# EAGLE design CleverBoard_V1 (EAGLE 9.6.2)

## Sheet 1 of 2
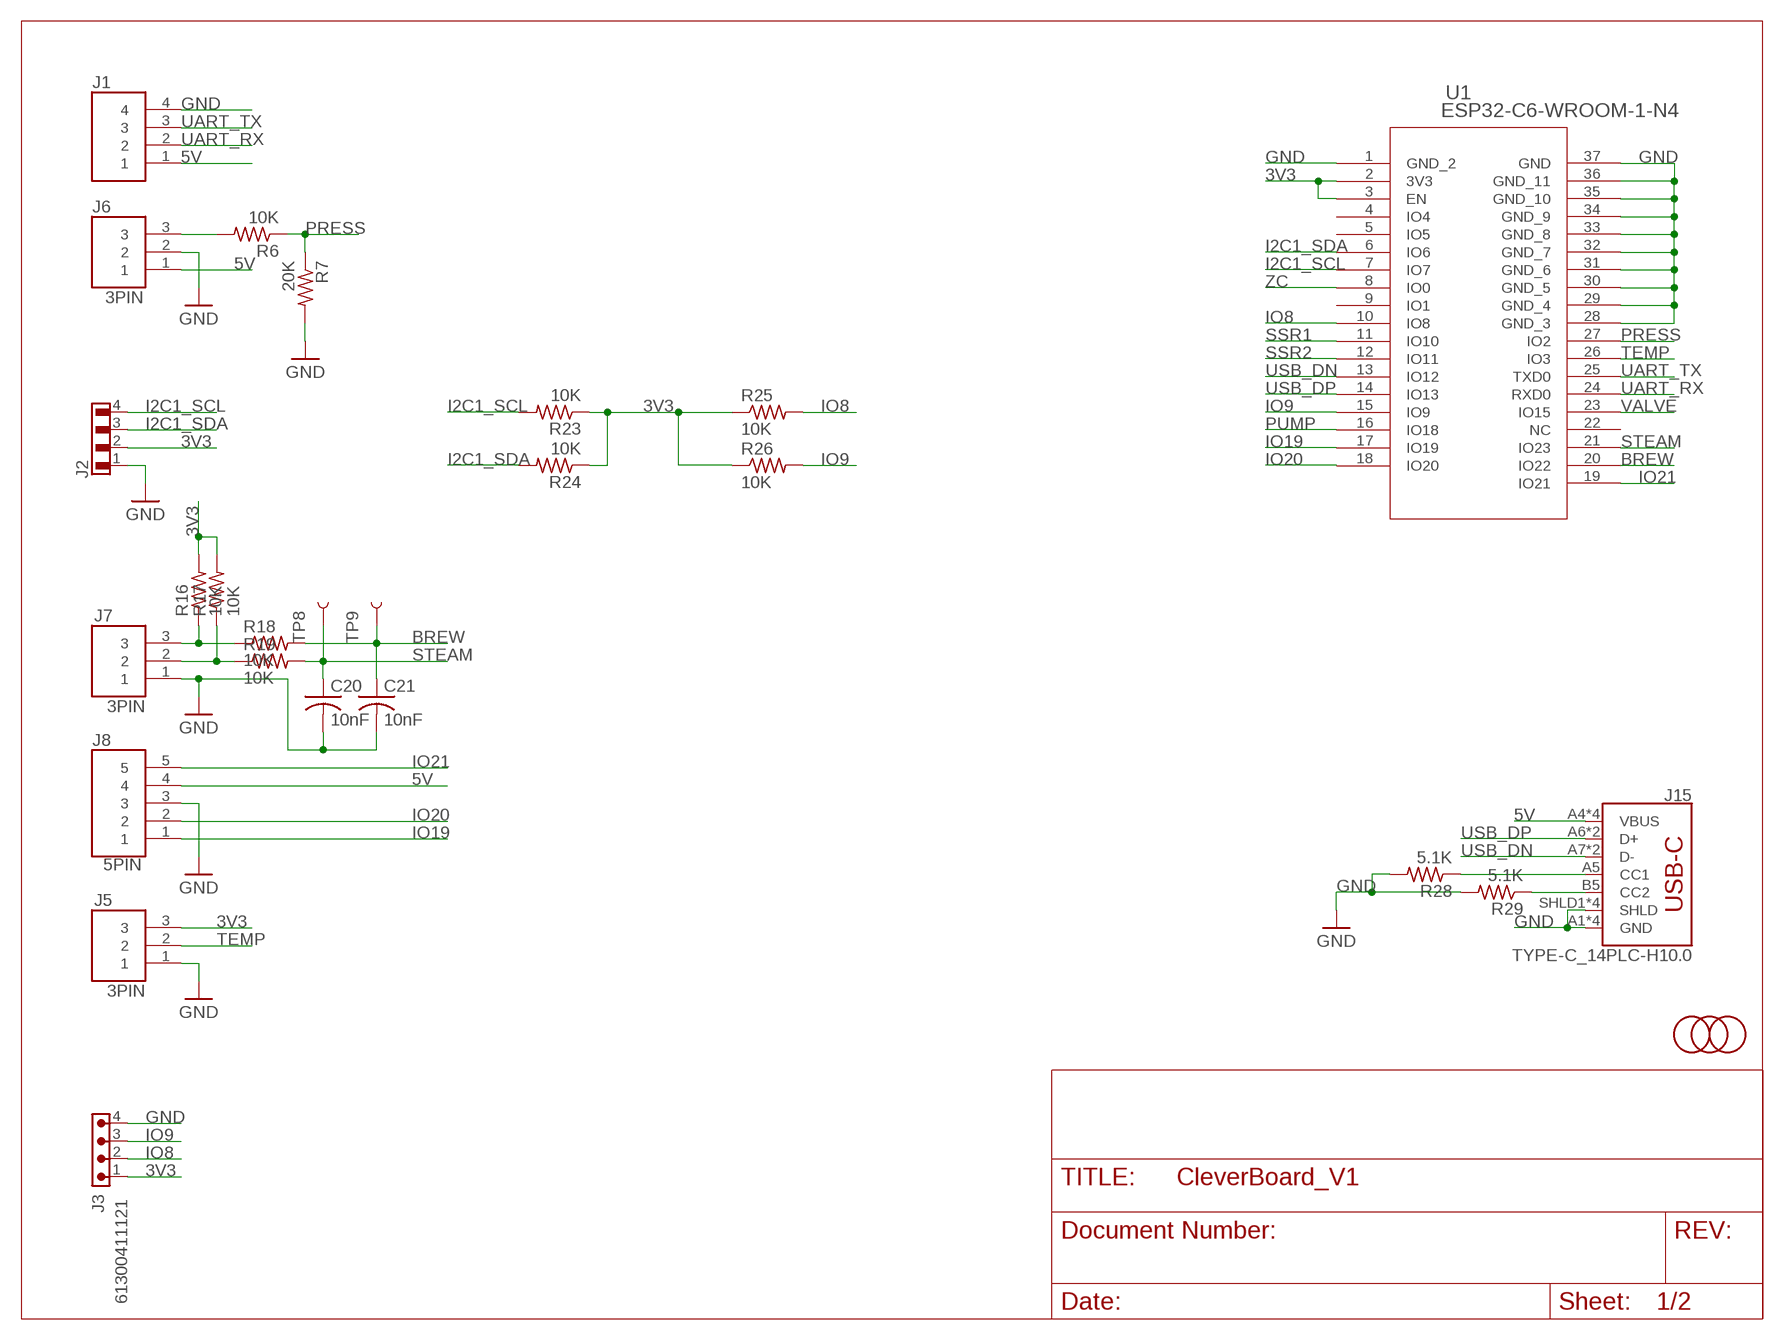
[diagram p0: schematic, sheet 1]

### Parts
C20  10nF  C-USC0603  [C0603]
C21  10nF  C-USC0603  [C0603]
J1  4PIN  [B4B-PH-K-S]
J2  665104131822  [665104131822]
J3  61300411121  6130XX11121_61300411121  [61300411121]
J5  3PIN  [B3B-PH-K-S]
J6  3PIN  [B3B-PH-K-S]
J7  3PIN  [B3B-PH-K-S]
J8  5PIN  [B5B-PH-K-S]
J15  TYPE-C_14PLC-H10.0  [TYPE-C_14PLC-H10.0]
MARK1  FIDUCIAL  [FIDUCIAL_1MM]
MARK2  FIDUCIAL  [FIDUCIAL_1MM]
MARK5  FIDUCIAL  [FIDUCIAL_1MM]
R6  10K  R-US_R0603  [R0603]
R7  20K  R-US_R0603  [R0603]
R16  10K  R-US_R0603  [R0603]
R17  10K  R-US_R0603  [R0603]
R18  10K  R-US_R0603  [R0603]
R19  10K  R-US_R0603  [R0603]
R23  10K  R-US_R0603  [R0603]
R24  10K  R-US_R0603  [R0603]
R25  10K  R-US_R0603  [R0603]
R26  10K  R-US_R0603  [R0603]
R28  5.1K  R-US_R0603  [R0603]
R29  5.1K  R-US_R0603  [R0603]
TP8  TEST-POINT3  [PAD.03X.03]
TP9  TEST-POINT3  [PAD.03X.03]
U1  ESP32-C6-WROOM-1-N4  [MOD28_ESP32-C6-WROOM-1_EXP]

### Nets
3V3: J2.2 J3.1 J5.3 R16.2 R17.2 R23.1 R24.1 R25.1 R26.1 U1.2(3V3) U1.3(EN) ; also sheet 2
5V: J1.1 J6.1 J8.4 J15.A4(VBUS) J15.A9(VBUS) J15.B4(VBUS) J15.B9(VBUS) ; also sheet 2
BREW: C21.1 R18.2 TP9.1 U1.20(IO22)
CC1: J15.A5(CC1) R28.1
CC2: J15.B5(CC2) R29.1
GND: C20.2 C21.2 J1.4 J2.1 J3.4 J5.1 J6.2 J7.1 J8.3 J15.A1(GND) J15.A12(GND) J15.B1(GND) J15.B12(GND) J15.SHLD1(SHLD) J15.SHLD2(SHLD) J15.SHLD3(SHLD) J15.SHLD4(SHLD) R7.2 R28.2 R29.2 U1.1(GND_2) U1.28(GND_3) U1.29(GND_4) U1.30(GND_5) U1.31(GND_6) U1.32(GND_7) U1.33(GND_8) U1.34(GND_9) U1.35(GND_10) U1.36(GND_11) U1.37(GND) ; also sheet 2
I2C1_SCL: J2.4 R23.2 U1.7(IO7)
I2C1_SDA: J2.3 R24.2 U1.6(IO6)
IO8: J3.2 R25.2 U1.10(IO8)
IO9: J3.3 R26.2 U1.15(IO9)
IO19: J8.1 U1.17(IO19)
IO20: J8.2 U1.18(IO20)
IO21: J8.5 U1.19(IO21)
N$5: J7.3 R16.1 R18.1
N$6: J7.2 R17.1 R19.1
N$25: J6.3 R6.2
PRESS: R6.1 R7.1 U1.27(IO2)
PUMP: U1.16(IO18) ; also sheet 2
SSR1: U1.11(IO10) ; also sheet 2
SSR2: U1.12(IO11) ; also sheet 2
STEAM: C20.1 R19.2 TP8.1 U1.21(IO23)
TEMP: J5.2 U1.26(IO3)
UART_RX: J1.2 U1.24(RXD0)
UART_TX: J1.3 U1.25(TXD0)
USB_DN: J15.A7(D-) J15.B7(D-) U1.13(IO12)
USB_DP: J15.A6(D+) J15.B6(D+) U1.14(IO13)
VALVE: U1.23(IO15) ; also sheet 2
ZC: U1.8(IO0) ; also sheet 2
Unconnected: U1.4(IO4) U1.5(IO5) U1.9(IO1) U1.22(NC)

## Sheet 2 of 2
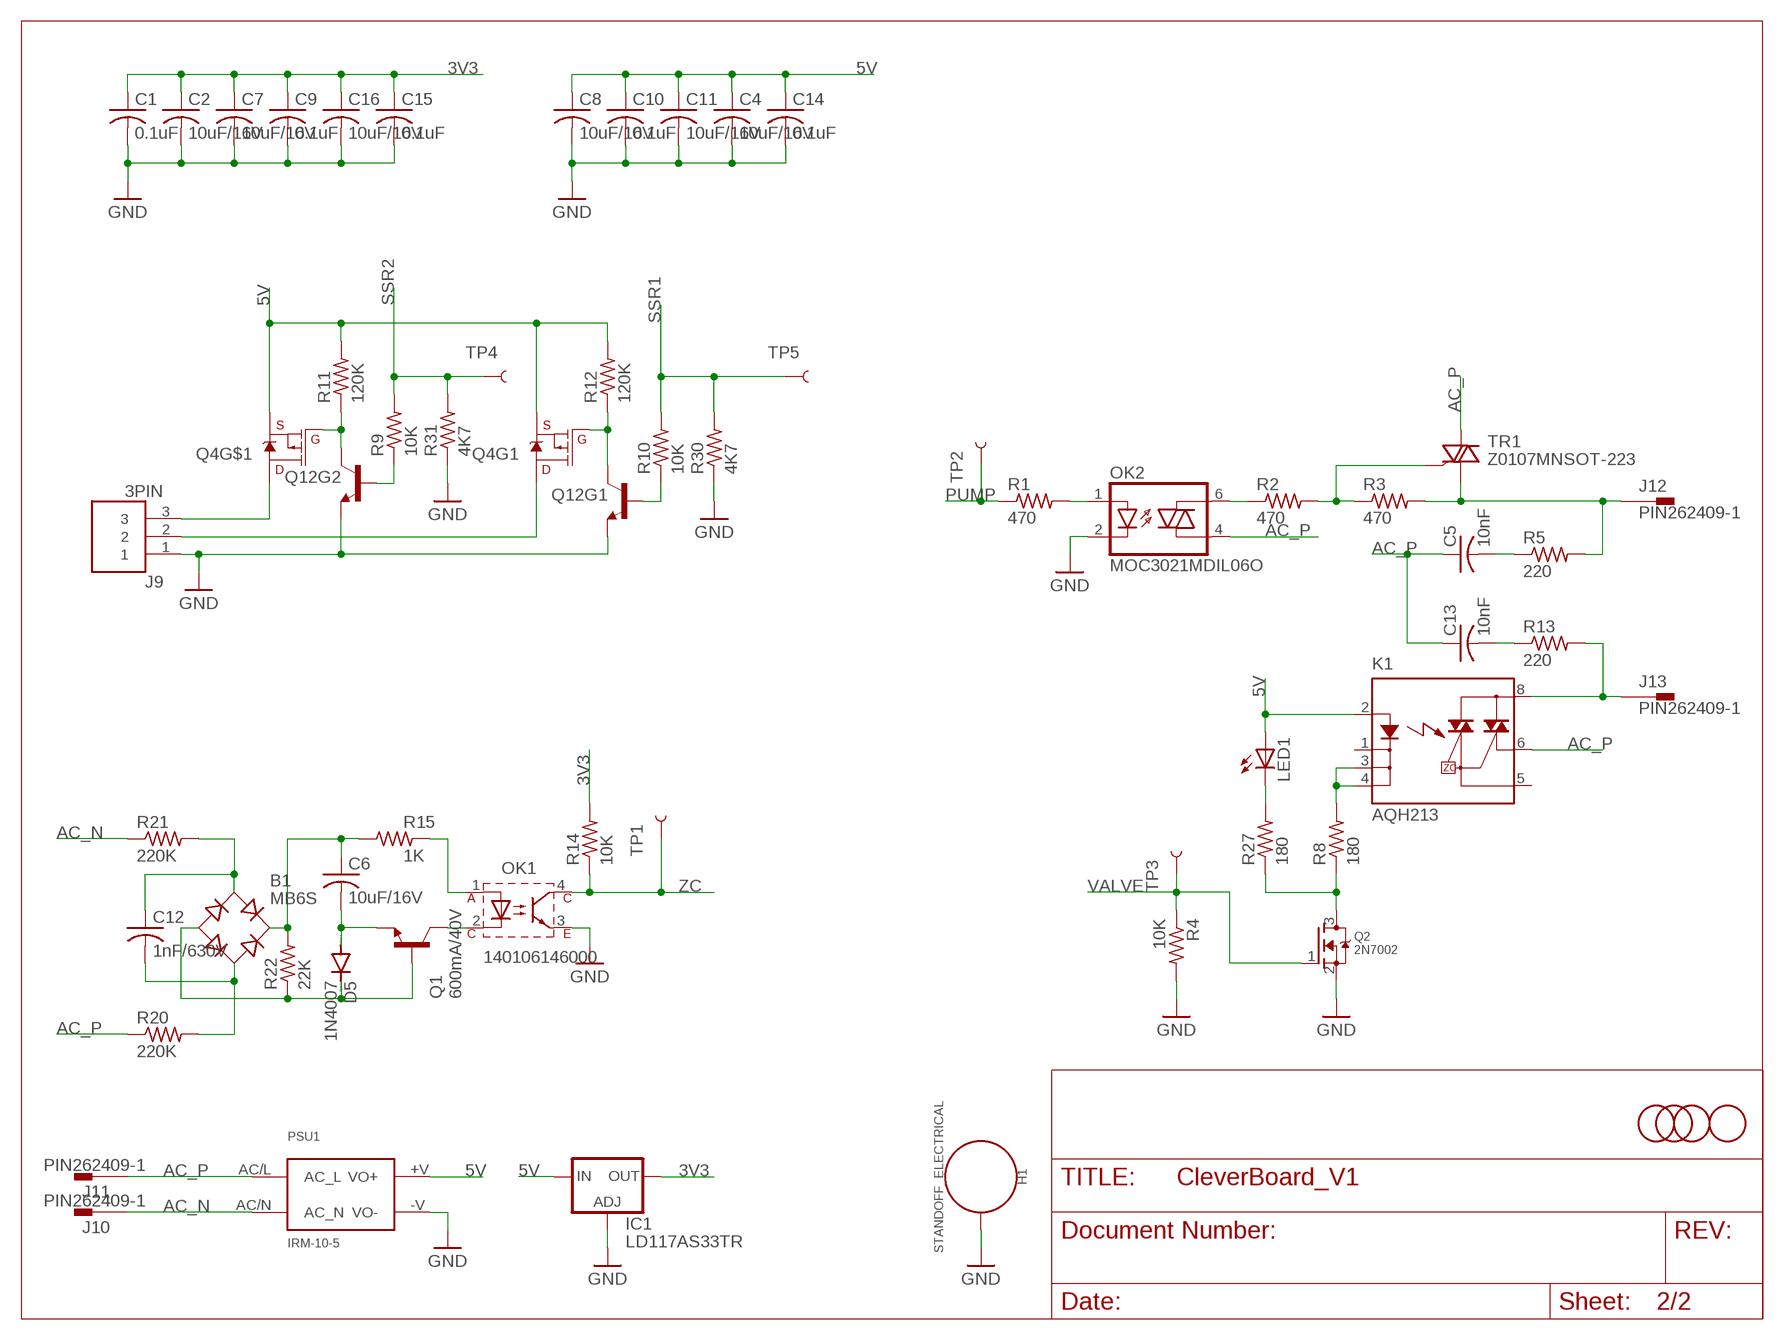
[diagram p1: schematic, sheet 2]

### Parts
B1  MB6S  [SOIC-4]
C1  0.1uF  C-USC0603  [C0603]
C2  10uF/16V  C-USC0603  [C0603]
C4  10uF/16V  C-USC0603  [C0603]
C5  10nF  C-USC1206  [C1206]
C6  10uF/16V  C-USC0603  [C0603]
C7  10uF/16V  C-USC0603  [C0603]
C8  10uF/16V  C-USC0603  [C0603]
C9  0.1uF  C-USC0603  [C0603]
C10  0.1uF  C-USC0603  [C0603]
C11  10uF/16V  C-USC0603  [C0603]
C12  1nF/630V  C-USC0805  [C0805]
C13  10nF  C-USC1206  [C1206]
C14  0.1uF  C-USC0603  [C0603]
C15  0.1uF  C-USC0603  [C0603]
C16  10uF/16V  C-USC0603  [C0603]
D5  1N4007  DIODE-DO214AC  [DO214AC]
H1  STANDOFF_ELECTRICAL  [STANDOFF-ELECTRICAL]
IC1  LD117AS33TR  [SOT223]
J9  3PIN  [B3B-PH-K-S]
J10  PIN262409-1  [62409-1]
J11  PIN262409-1  [62409-1]
J12  PIN262409-1  [62409-1]
J13  PIN262409-1  [62409-1]
K1  AQH213  [DIL07]
LED1  LEDCHIP-LED0603  [CHIP-LED0603]
MARK4  FIDUCIAL  [FIDUCIAL_1MM]
MARK6  FIDUCIAL  [FIDUCIAL_1MM]
MARK7  FIDUCIAL  [FIDUCIAL_1MM]
MARK8  FIDUCIAL  [FIDUCIAL_1MM]
OK1  140106146000  WL-OCPT_SERIES_101X_140106146000  [WL-OCPT_LSOP4]
OK2  MOC3021MDIL06O  [DIL06O]
PSU1  IRM-10-5  [IRM-10]
Q1  600mA/40V  TRANS_NPN-MMBT2222AL  [SOT23-3]
Q2  2N7002  MOSFET-NREFLOW  [SOT23-R]
Q4  MOSFET_PCH_DUAL-DMP2240UDM  [SOT26]
Q12  TRANS_NPN_DUAL-MBT3904DW1T1  [SC70-6]
R1  470  R-US_R0603  [R0603]
R2  470  R-US_R0603  [R0603]
R3  470  R-US_R0603  [R0603]
R4  10K  R-US_R0603  [R0603]
R5  220  R-US_R2512  [R2512]
R8  180  R-US_R0603  [R0603]
R9  10K  R-US_R0603  [R0603]
R10  10K  R-US_R0603  [R0603]
R11  120K  R-US_R0603  [R0603]
R12  120K  R-US_R0603  [R0603]
R13  220  R-US_R2512  [R2512]
R14  10K  R-US_R0603  [R0603]
R15  1K  R-US_R0603  [R0603]
R20  220K  R-US_R1206  [R1206]
R21  220K  R-US_R1206  [R1206]
R22  22K  R-US_R0603  [R0603]
R27  180  R-US_R0603  [R0603]
R30  4K7  R-US_R0603  [R0603]
R31  4K7  R-US_R0603  [R0603]
TP1  TEST-POINT3  [PAD.03X.03]
TP2  TEST-POINT3  [PAD.03X.03]
TP3  TEST-POINT3  [PAD.03X.03]
TP4  TEST-POINT3  [PAD.03X.03]
TP5  TEST-POINT3  [PAD.03X.03]
TR1  Z0107MNSOT-223  [SOT223]

### Nets
3V3: C1.1 C2.1 C7.1 C9.1 C15.1 C16.1 IC1.4(OUT) R14.2 ; also sheet 1
3WAY: J13.A1 J13.A2 K1.8(DS1) R13.2
5V: C4.1 C8.1 C10.1 C11.1 C14.1 IC1.3(IN) K1.2(A) LED1.A PSU1.+V(VO+) Q4.S1(S) Q4.S2(S) R11.2 R12.2 ; also sheet 1
AC_N: J10.A1 J10.A2 PSU1.AC/N(AC_N) R21.1
AC_P: C5.1 C13.1 J11.A1 J11.A2 K1.6(DS3) OK2.4(A1) PSU1.AC/L(AC_L) R20.1 TR1.2(A2) TR1.4(A2)
GND: C1.2 C2.2 C4.2 C7.2 C8.2 C9.2 C10.2 C11.2 C14.2 C15.2 C16.2 H1.P1 IC1.1(ADJ) J9.1 OK1.3 OK2.2(C) PSU1.-V(VO-) Q2.2(S) Q12.1(E) Q12.4(E) R4.2 R30.1 R31.1 ; also sheet 1
N$2: B1.- D5.C Q1.1(B) R22.1
N$3: LED1.C R27.2
N$4: OK2.6(A2) R2.1
N$7: OK1.2 Q1.3(C)
N$8: R2.2 R3.1 TR1.3(G)
N$11: Q2.3(D) R8.1 R27.1
N$13: K1.3(K1) K1.4(K2) R8.2
N$15: C13.2 R13.1
N$16: C5.2 R5.1
N$36: B1.~1(AC1) C12.2 R20.2
N$37: B1.~2(AC2) C12.1 R21.2
N$39: OK2.1(A) R1.2
N$43: C6.2 D5.A Q1.2(E)
N$44: OK1.1 R15.2
N$45: B1.+ C6.1 R15.1 R22.2
N$46: Q12.2(B) R9.1
N$47: Q4.G1(G) Q12.3(C) R12.1
N$48: Q4.G2(G) Q12.6(C) R11.1
N$49: Q12.5(B) R10.1
PUMP: R1.1 TP2.1 ; also sheet 1
PUMP_P: J12.A1 J12.A2 R3.2 R5.2 TR1.1(A1)
R1: J9.2 Q4.D1(D)
R2: J9.3 Q4.D2(D)
SSR1: R10.2 R30.2 TP5.1 ; also sheet 1
SSR2: R9.2 R31.2 TP4.1 ; also sheet 1
VALVE: Q2.1(G) R4.1 TP3.1 ; also sheet 1
ZC: OK1.4 R14.1 TP1.1 ; also sheet 1
Unconnected: K1.1(K) K1.5(DS2)

## Library data of the parts
B1 = rectifier:MB*S: Bridge Rectifier Source: http://www.fairchildsemi.com/ds/MB/MB6S.pdf; LCSC: C2487
C1 C9 C10 C14 C15 = rcl:C-US: CAPACITOR, American symbol; LCSC: C1591; SPICEPREFIX: C
C2 C4 C6-C8 C11 C16 = rcl:C-US: CAPACITOR, American symbol; LCSC: C86275; SPICEPREFIX: C
C5 C13 = rcl:C-US: CAPACITOR, American symbol; LCSC: C107192; SPICEPREFIX: C
C12 = rcl:C-US: CAPACITOR, American symbol; LCSC: C501242; SPICEPREFIX: C
C20 C21 = rcl:C-US: CAPACITOR, American symbol; LCSC: C100042; SPICEPREFIX: C
D5 = diode:DIODE-: DIODE; LCSC: C727081
H1 = SparkFun-Hardware:STANDOFF_ELECTRICAL: Stand Off Drill holes with an electrical connection. For example, use these to ground your board to a chassis. Example SparkFun Products Screw - Phillips Head (1/4", 4-40, 10 pack) <https://www.sparkfun.com/products/10453> (PRT-10453) Screw - Phillips Head (1/2", 4-40, 10 pack) <https://www.sparkfun.com/products/10452> (PRT-10452) Screw - Phillips Head (3/4", 4-40, 10 pack) <https://www.sparkfun.com/products/10451> (PRT-10451) Screw - Phillips Head (1", 4-40, 10 pack) <https://www.sparkfun.com/products/10450> (PRT-10450)
IC1 = v-reg:LD117A?*: Low drop fixed and adjustable positive voltage regulators 1 A Source: http://www.st.com/stonline/products/literature/ds/7194/ld1117axx.pdf; LCSC: C26537
J1 = jst_eph:4PIN; LCSC: C131334
J2 = Wurth_Connectors_WR-WTB:665104131822: WR-WTB 1.00 mm SMT Male Horizontal Shrouded KIND PROPERTIES: Pitch:1 mm Gender:Male MATERIAL PROPERTIES: Insulator Material :PA46 Insulator Flammability Rating:UL94 V-0 Color:Beige Contact Material:Phosphor Bronze Contact Plating:Tin Contact Type:Stamped GENERAL INFORMATION Operating Temperature:-25 up to +85 °C Compliance: RoHS Working Voltage:50 V (AC) Withstanding Voltage:500 V (AC) Contact Resistance:20 mΩ RISO:100MΩ CERTIFICATION UL Approval:E323964 PACKAGING PROPERTIES Packaging:Tape and Reel with Cap <https://katalog.we-online.com/media/images/v2/o58871v209%20Fam_WR-WTB_SMT_Male_Horizontal_Shrouded_Header_6651xx131822.jpg> Details see: https://katalog.we-online.com/en/em/WTB_1_00_SMT_MALE_HORIZONTAL_SHROUDED_HEADER_6651XX131822 Updated by Yingchun,Shan 2019-11-11 2019 (C) Würth Elektronik; CONTACT-RESISTANCE: 20mOhm; DATASHEET-URL: https://www.we-online.com/redexpert/spec/665104131822?ae; GENDER: Male; IR: 1A; L: 6mm; LCSC: C160390; MOUNT: SMT; PACKAGING: Tape and Reel; PART-NUMBER: 665104131822; PCB-CABLE-PANEL: PCB; PINS: 4; PITCH: 1mm; TYPE: Horizontal; WORKING-VOLTAGE: 50V(AC)
J3 = Wurth_Connectors_WR-PHD:6130XX11121_61300411121: WR-PHD 2.54 mm THT Pin Header ARTICLE PROPERTIES: Pins:1;​ 2;​ 3;​ 4;​ 5;​ 6;​ 7;​ 8;​ 9;​ 10;​ 12;​ 13;​ 14;​ 15;​ 16;​ 18;​ 20;​ 22;​ 24;​ 25;​ 32;​ 36;​ 40 KIND PROPERTIES: Pitch：2.54 mm Quality Class:3 as per CECC 75 301-802 Rows：Single Gender：Pin Header Type：Straight MATERIAL PROPERTIES: Insulator Material PA6T; PBT Insulator Flammability Rating:UL94 V-0 Contact Material:Copper Alloy Contact Plating:Gold Contact Type:Stamped GENERAL INFORMATION Operating Temperature:-40 up to +105 °C ELECTRICAL PROPERTIES: Withstanding Voltage 500 V (AC) Contact Resistance 20 mΩ RISO 1000 MΩ CERTIFICATION UL Approval:E323964 PACKAGING PROPERTIES Packaging:Bag <https://www.we-online.com/catalog/media/o33211v209%20Family_BTB_PHD_6130xx11121.jpg> Details see: https://www.we-online.com/katalog/en/em/PHD_2_54_THT_PIN_HEADER_6130XX11121 Updated by Ella Wu 2021-12-08 2021 (C) Würth Elektronik; DATASHEET-URL: https://www.we-online.com/redexpert/spec/61300411121?ae; GENDER: Pin Header; IR: 3A; LCSC: C2691448; MOUNT: THT; PACKAGING: Bag; PART-NUMBER: 61300411121; PINS: 4; PITCH: 2.54mm; ROWS: Single; TYPE: Straight
J5-J7 J9 = jst_eph:3PIN; LCSC: C131339
J8 = jst_eph:5PIN; LCSC: C157993
J10-J13 = con-faston:PIN2: Flachstecker Typ Tyco/Electronics/AMP TAB, FASTON Printed Circuit Board Tabs Source: http://www.buerklin.com, http://catalog.tycoelectronics.com; LCSC: C86495; OC_FARNELL: unknown; OC_NEWARK: unknown
J15 = discrete:TYPE-C_14PLC-H10.0: TYPE-C_14PLC-H10.0; LCSC: C3151746
K1 = relay:AQH*213: SOLID STATE RELAY NAiS Source: http://www.mew-europe.com/.. en_ds_61613_0000.pdf; LCSC: C719560; OC_FARNELL: unknown; OC_NEWARK: unknown
LED1 = adafruit:LED: LED OSRAM: - CHIPLED LG R971, LG N971, LY N971, LG Q971, LY Q971, LO R971, LY R971 LH N974, LH R974 LS Q976, LO Q976, LY Q976 LO Q996 - Hyper CHIPLED LW Q18S LB Q993, LB Q99A, LB R99A - SideLED LS A670, LO A670, LY A670, LG A670, LP A670 LB A673, LV A673, LT A673, LW A673 LH A674 LY A675 LS A676, LA A676, LO A676, LY A676, LW A676 LS A679, LY A679, LG A679 - Hyper Micro SIDELED® LS Y876, LA Y876, LO Y876, LY Y876 LT Y87S - SmartLED LW L88C, LW L88S LB L89C, LB L89S, LG L890 LS L89K, LO L89K, LY L89K LS L896, LA L896, LO L896, LY L896 - TOPLED LS T670, LO T670, LY T670, LG T670, LP T670 LSG T670, LSP T670, LSY T670, LOP T670, LYG T670 LG T671, LOG T671, LSG T671 LB T673, LV T673, LT T673, LW T673 LH T674 LS T676, LA T676, LO T676, LY T676, LB T676, LH T676, LSB T676, LW T676 LB T67C, LV T67C, LT T67C, LS T67K, LO T67K, LY T67K, LW E67C LS E67B, LA E67B, LO E67B, LY E67B, LB E67C, LV E67C, LT E67C LW T67C LS T679, LY T679, LG T679 LS T770, LO T770, LY T770, LG T770, LP T770 LB T773, LV T773, LT T773, LW T773 LH T774 LS E675, LA E675, LY E675, LS T675 LS T776, LA T776, LO T776, LY T776, LB T776 LHGB T686 LT T68C, LB T68C - Hyper Mini TOPLED® LB M676 - Mini TOPLED Santana® LG M470 LS M47K, LO M47K, LY M47K Source: http://www.osram.convergy.de/; LCSC: C2286
MARK1 MARK2 MARK4-MARK8 = adafruit:FIDUCIAL: For use by pick and place machines to calibrate the vision/machine, 1mm By microbuilder.eu
OK1 = Wurth_Optocoupler_WL-OCPT:WL-OCPT_SERIES_101X: WL-OCPT LSOP-4 Series 101x Characteristics High isolation voltage Good stability of inner isolation Stable CTR in full operation temperature range Different CTR binnings available High Collector-Emitter voltage Fast switching times Applications Power Supply, charger Computers & Microprocessors Office equipment Instrumental applications, machines Ammeter, Smart Meter <https://www.we-online.de/katalog/media/o198230v209%20WL-OCPT_LSOP4_101x_multi-parts.jpg> Details see: www.we-online.com/catalog/WL-OCPT_PACKAGE_LSOP-4 <www.we-online.com/catalog/WL-OCPT_PACKAGE_LSOP-4/?utm_source=eagle_model&utm_medium=description_link&utm_campaign=eisos_eagle> Updated by Ella Wu, 2022-06-21 2022 (C) Wurth Elektronik; CTR-MAX: 300%; CTR-MIN: 100%; DATASHEET-URL: https://www.we-online.com/redexpert/spec/140106146000?ae; IF: 60mA; LCSC: C141610; MOUNT: SMT; PART-NUMBER: 140106146000; TC-CTR: IF = 5mA,VCE = 5 V; VCE: 80V; VISO: 5000(V(RMS))
OK2 = discrete:MOC3021M: RANDOM-PHASE OPTOISOLATORS TRIAC DRIVER OUTPUT; LCSC: C5242
PSU1 = discrete:IRM-10-5: MEAN WELL IRM-10-5 5V 10W Output Switching Power Supply; LCSC: C2857903; SPICEPREFIX: E
Q1 = SparkFun-DiscreteSemi:TRANS_NPN: NPN transistor Current controlled devices typically used to amplify current or used as a switch. BC547 - COM-08928 <http://www.sparkfun.com/products/8928> (TO-92 45V 100mA) (1.Collector 2.Base 3.Emitter) 2N3904 - COM-00521 <http://www.sparkfun.com/products/521> (TO-92 40V 200mA) (1.Emitter 2.Base 3.Collector) P2N2222A - COM-12852 <http://www.sparkfun.com/products/12852> (TO-92 40V 600mA) (1.Collector 2.Base 3.Emitter); LCSC: C82460; PROD_ID: TRANS-08049
Q2 = microbuilder:MOSFET-N: N-Channel Mosfet LEGEND VDS: Voltage Drain-Source ID: Drain Current RDS(ON): Drain-Source On-State Resistance VGS(TH): Gate-Source Threshold Voltage CISS: Drain-Source Input Capacitance SOT-23 Name VDS ID RDS(ON) VGS(TH) CISS Order Number 2N7002E 60V 260mA 2.5 Ohm 2.5V @ 250uA 26.7pF @ 25V 2N7002ET1GOSTR-ND BSH103 30V 850mA 400 mOhm 400mV @ 1mA 83pF @ 24V BSH103,235-ND BSS138 60V 320mA 1.6 Ohm 1.5V @ 250uA 50pF @ 10V Mouser: 771-BSS138PW115 DMN2075U-7 20V 4.2A 38 mOhm 1V @ 250 uA 594.3pF @ 10V DMN2075U-7DICT-ND * BSS138 good choice for I2C level-shifting; LCSC: C65189
Q4 = SparkFun-DiscreteSemi:MOSFET_PCH_DUAL: Dual P-Channel -20VDS MOSFET Link to datasheet <http://www.diodes.com/_files/datasheets/ds31197.pdf> SparkFun Products: SparkFun FreeSoC2 Development Board <https://www.sparkfun.com/products/13229>; LCSC: C397948; PROD_ID: TRANS-12444; VALUE: 2A/20V/150mΩ
Q12 = SparkFun-DiscreteSemi:TRANS_NPN_DUAL: Dual NPN Transistors in Single Package The MBT3904W1 puts two general purpose 3904 NPN transistors in a single package. Datasheet <http://www.onsemi.com/pub_link/Collateral/MBT3904DW1T1-D.PDF> SparkFun Products: SparkFun ESP32 Thing <https://www.sparkfun.com/products/13907>; LCSC: C896759; PROD_ID: TRANS-13337
R1-R3 = rcl:R-US_: RESISTOR, American symbol; LCSC: C114669; SPICEPREFIX: R
R4 R6 R9 R10 R14 R16-R19 R23-R26 = rcl:R-US_: RESISTOR, American symbol; LCSC: C98220; SPICEPREFIX: R
R5 R13 = rcl:R-US_: RESISTOR, American symbol; LCSC: C877859; SPICEPREFIX: R
R7 = rcl:R-US_: RESISTOR, American symbol; LCSC: C105575; SPICEPREFIX: R
R8 R27 = rcl:R-US_: RESISTOR, American symbol; LCSC: C137786; SPICEPREFIX: R
R11 R12 = rcl:R-US_: RESISTOR, American symbol; LCSC: C114607; SPICEPREFIX: R
R15 = rcl:R-US_: RESISTOR, American symbol; LCSC: C22548; SPICEPREFIX: R
R20 R21 = rcl:R-US_: RESISTOR, American symbol; LCSC: C130275; SPICEPREFIX: R
R22 = rcl:R-US_: RESISTOR, American symbol; LCSC: C114065; SPICEPREFIX: R
R28 R29 = rcl:R-US_: RESISTOR, American symbol; LCSC: C105580; SPICEPREFIX: R
R30 R31 = rcl:R-US_: RESISTOR, American symbol; LCSC: C99782; SPICEPREFIX: R
TP1-TP5 TP8 TP9 = SparkFun-Connectors:TEST-POINT: SparkFun Test Points Bare copper test points for troubleshooting or In-Circuit-Testing. These are used by our Production team for verifying production board runs using pogo-pins on test beds. SparkFun Products: SparkFun LSM9DS1 Breakout <https://www.sparkfun.com/products/13284> SparkFun PSOC <https://www.sparkfun.com/products/13714> SparkFun Load Cell Amplifier <https://www.sparkfun.com/products/13879>
TR1 = discrete:Z0107MN: Triacs 1.0 Amp 600 Volt; LCSC: C71218
U1 = discrete:ESP32-C6-WROOM-1-N4; COPYRIGHT: Copyright (C) 2025 Ultra Librarian. All rights reserved.; LCSC: C5366877; MANUFACTURER_PART_NUMBER: ESP32-C6-WROOM-1-N4; MFR_NAME: Espressif Systems; TYPE: RF

## Net classes
0 default: clearance 0.152 mm
1 TC: clearance 0.508 mm
2 Analog: clearance 0.254 mm
3 Clock: clearance 0.254 mm

## Board
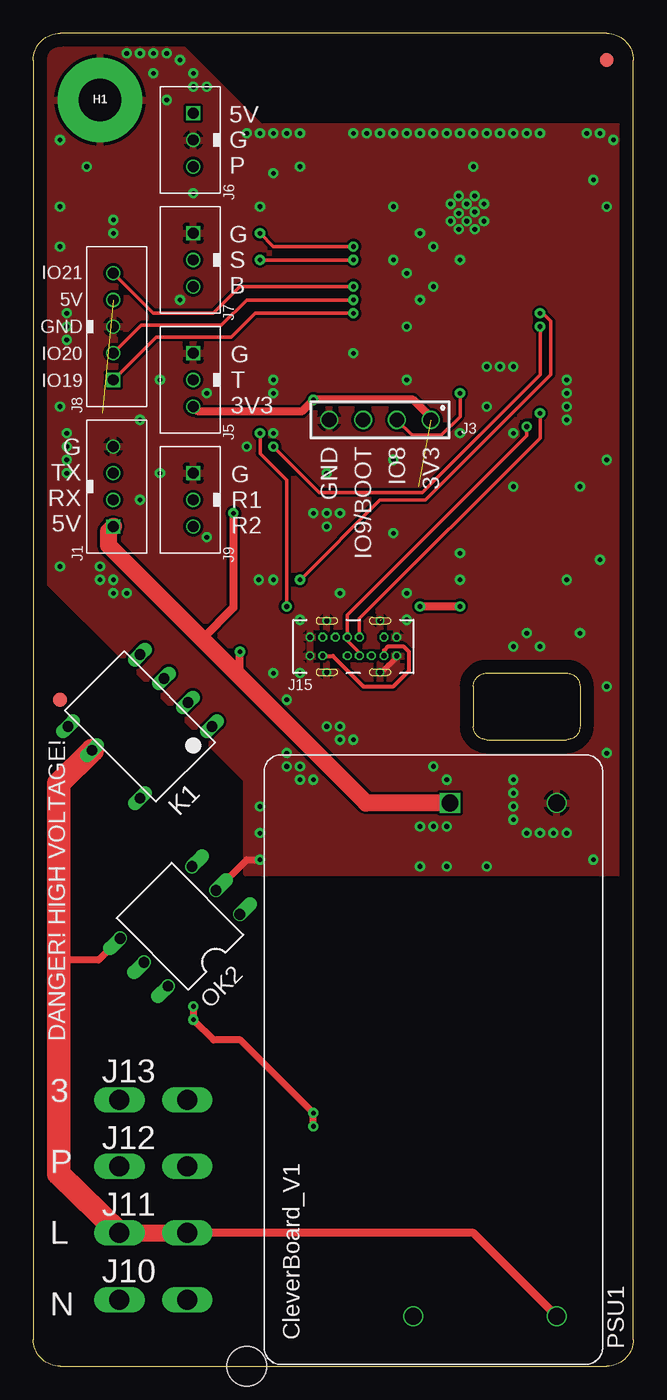
[diagram p2: board, top side]
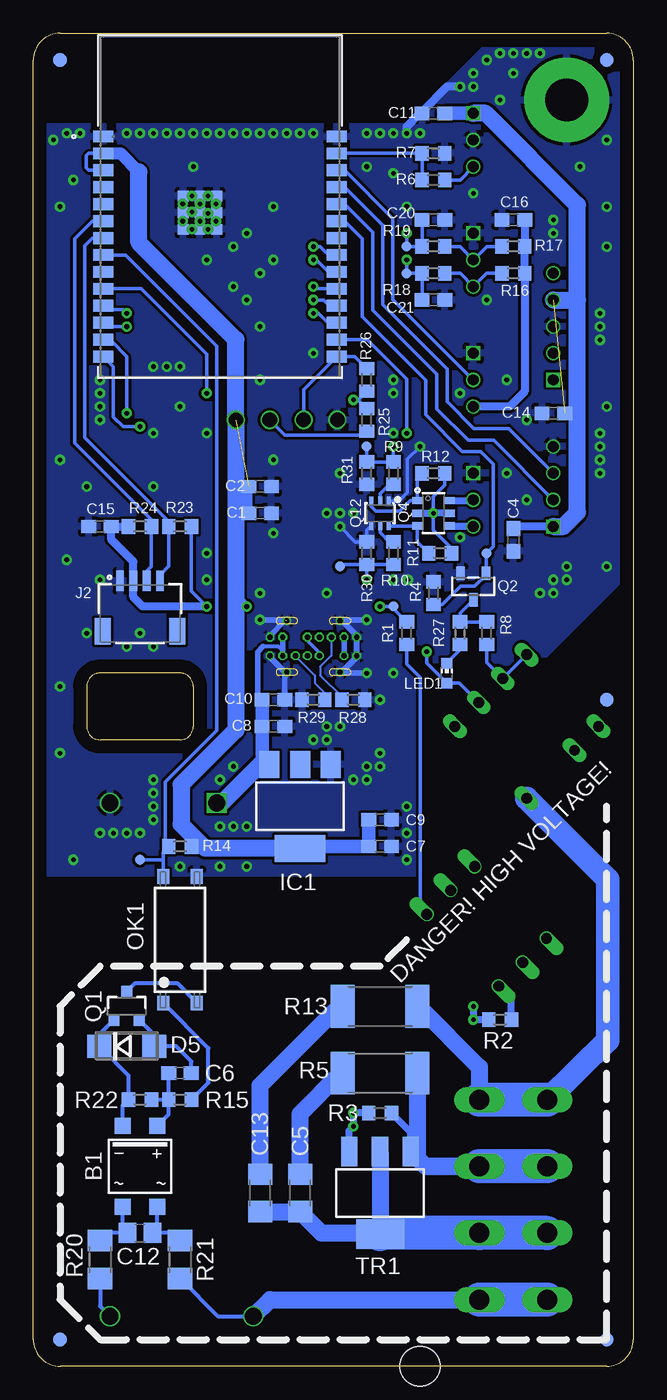
[diagram p3: board, bottom side, seen from below]

Size 45 x 100 mm. Coordinates in mm from the lower left corner, seen from the top.
Outline: 2,0 43,0 arc90 45,2 45,98 arc90 43,100 2,100 arc90 0,98 0,2 arc90 2,0
Outline: 34,52 40,52 arc-90 41,51 41,48 arc-90 40,47 34,47 arc-90 33,48 33,51 arc-90 34,52
Copper layers (1*16): Top 0.035mm / dielectric 1.5mm / Bottom 0.035mm
Design rules "GaggiaBoard_V3.1": minimum track width 6mil, minimum drill 0.35mm, track to track 0.205mm, track to pad 0.205mm, pad to pad 0.205mm, via to via 0.205mm, smd to smd 6mil, copper to edge 40mil, drill to drill 6mil, minimum pad ring 5mil, minimum via ring 8mil, stop-mask expansion 4mil, vias tented up to drill 100mil, thermal gap 10mil
Holes 3 mm at 16,0

### Footprints (pad centres in the part's own frame; a part is rotated, then mirrored left to right if it is on the bottom)
SOIC-4 = smd 1.2 x 1.2: + 1.3,3.05; - -1.3,3.05; ~1 -1.3,-3.05; ~2 1.3,-3.05
C0603 = smd 1.1 x 1: 1 -0.85,0; 2 0.85,0
C1206 = smd 1.6 x 1.8: 1 -1.4,0; 2 1.4,0
C0805 = smd 1.3 x 1.5: 1 -0.95,0; 2 0.95,0
DO214AC = smd 1.8 x 1.7: A 2.05,0; C -2.05,0
STANDOFF-ELECTRICAL = drill 3.2 pad 6.35: P1 0,0
SOT223 = smd 1.5 x 2: 1 -2.3,-3.15; 2 0,-3.15; 3 2.3,-3.15 | smd 3.8 x 2: 4 0,3.15
B4B-PH-K-S = drill 0.813 square: 1 3,0 | drill 0.813: 2 1,0; 3 -1,0; 4 -3,0
665104131822 = smd 0.6 x 1.55: 1 -1.5,1.92; 2 -0.5,1.92; 3 0.5,1.92; 4 1.5,1.92 | smd 1.2 x 2: Z1 -2.8,-1.855; Z2 2.8,-1.855
61300411121 = drill 1.1: 1 -3.81,0; 2 -1.27,0; 3 1.27,0; 4 3.81,0
B3B-PH-K-S = drill 0.813 square: 1 2,0 | drill 0.813: 2 0,0; 3 -2,0
B5B-PH-K-S = drill 0.813 square: 1 4,0 | drill 0.813: 2 2,0; 3 0,0; 4 -2,0; 5 -4,0
62409-1 = drill 1.5 pad 1.9 long: A1 -2.54,0; A2 2.54,0
TYPE-C_14PLC-H10.0 = drill 0.4 pad 0.61 octagon: A1 -3.25,0.7; A4 -2.3,0.7; A5 -1.35,0.7; A6 -0.45,0.7; A7 0.45,0.7; A9 2.3,0.7; A12 3.25,0.7; B1 3.25,-0.7; B4 2.3,-0.7; B5 1.35,-0.7; B6 0.45,-0.7; B7 -0.45,-0.7; B9 -2.3,-0.7; B12 -3.25,-0.7 | drill 0.4: SHLD1 -2,1.93; SHLD2 2,1.93; SHLD3 -2,-1.93; SHLD4 2,-1.93
DIL07 = drill 0.8 long: 1 -3.81,-3.81; 2 -1.27,-3.81; 3 1.27,-3.81; 4 3.81,-3.81; 5 3.81,3.81; 6 1.27,3.81; 8 -3.81,3.81
CHIP-LED0603 = smd 0.8 x 0.8: A 0,-0.75; C 0,0.75
FIDUCIAL_1MM = smd 1 x 1: 1 0,0
WL-OCPT_LSOP4 = smd 1.1 x 0.9: 1 -4.75,1.27; 2 -4.75,-1.27; 3 4.75,-1.27; 4 4.75,1.27
DIL06O = drill 0.813 offset: 1 -2.54,-3.81; 2 0,-3.81; 3 2.54,-3.81; 4 2.54,3.81; 5 0,3.81; 6 -2.54,3.81
IRM-10 = drill 1.27 square: +V 19.25,-1.25 | drill 1.27: -V 19.25,-9.25; AC/L -19.25,-9.25; AC/N -19.25,1.5
SOT23-3 = smd 0.8 x 0.9: 1 -0.95,-1; 2 0.95,-1; 3 0,1.1
SOT23-R = smd 0.635 x 1.016: 1 -0.95,-1; 2 0.95,-1; 3 0,1
SOT26 = smd 0.55 x 0.8: D1 -0.95,1.2; D2 0.95,1.2; G1 -0.95,-1.2; G2 0.95,-1.2; S1 0,1.2; S2 0,-1.2
SC70-6 = smd 0.3 x 0.66: 1 -0.65,-0.92; 2 0,-0.92; 3 0.65,-0.92; 4 0.65,0.92; 5 0,0.92; 6 -0.65,0.92
R0603 = smd 1 x 1.1: 1 -0.85,0; 2 0.85,0
R2512 = smd 1.8 x 3.2: 1 -2.8,0; 2 2.8,0
R1206 = smd 1.6 x 1.803: 1 -1.422,0; 2 1.422,0
PAD.03X.03 = smd 0.762 x 0.762: 1 0,0
SOT223' = smd 1.219 x 2.235: 1 -2.311,-3.099; 2 0,-3.099; 3 2.311,-3.099 | smd 3.6 x 2.2: 4 0,3.099
MOD28_ESP32-C6-WROOM-1_EXP = smd 1.499 x 0.889: 1 -8.75,5.26; 2 -8.75,3.99; 3 -8.75,2.72; 4 -8.75,1.45; 5 -8.75,0.18; 6 -8.75,-1.09; 7 -8.75,-2.36; 8 -8.75,-3.63; 9 -8.75,-4.9; 10 -8.75,-6.17; 11 -8.75,-7.44; 12 -8.75,-8.71; 13 -8.75,-9.98; 14 -8.75,-11.25; 15 8.75,-11.25; 16 8.75,-9.98; 17 8.75,-8.71; 18 8.75,-7.44; 19 8.75,-6.17; 20 8.75,-4.9; 21 8.75,-3.63; 22 8.75,-2.36; 23 8.75,-1.09; 24 8.75,0.18; 25 8.75,1.45; 26 8.75,2.72; 27 8.75,3.99; 28 8.75,5.26 | smd 0.813 x 0.813: 29 -1.505,-0.46; 30 -2.755,0.79; 31 -2.755,-0.46; 32 -2.755,-1.71; 33 -1.505,-1.71; 34 -0.255,-1.71; 35 -0.255,-0.46; 36 -0.255,0.79; 37 -1.505,0.79

### Placement (x,y rotation side)
B1  37,15 0 bottom
C1  28,64 0 bottom
C2  28,66 0 bottom
C4  9,62 270 bottom
C5  25,13 90 bottom
C6  34,22 0 bottom
C7  19,39 0 bottom
C8  27,48 0 bottom
C9  19,41 0 bottom
C10  27,50 0 bottom
C11  15,94 180 bottom
C12  37,10 180 bottom
C13  28,13 90 bottom
C14  6,71.5 180 bottom
C15  40,63 180 bottom
C16  9,86 180 bottom
C20  15,86 0 bottom
C21  15,80 0 bottom
D5  38,24 0 bottom
H1  5,95 0 top
IC1  25,42 180 bottom
J1  6,66 270 top
J2  37,57 0 bottom
J3  26,71 180 top
J5  12,74 90 top
J6  12,92 90 top
J7  12,83 90 top
J8  6,78 270 top
J9  12,65 90 top
J10  9,5 0 top
J11  9,10 0 top
J12  9,15 0 top
J13  9,20 0 top
J15  24,54 0 top
K1  8,48 135 top
LED1  14,52 0 bottom
MARK1  43,2 0 bottom
MARK2  2,50 0 bottom
MARK4  2,2 0 bottom
MARK5  43,98 0 bottom
MARK6  2,98 0 bottom
MARK7  43,98 0 top
MARK8  2,50 0 top
OK1  34,32 90 bottom
OK2  11,33 135 top
PSU1  30,23 90 top
Q1  38,27 0 bottom
Q2  12,58.5 180 bottom
Q4  15,64 270 bottom
Q12  19,64 180 bottom
R1  17,55 270 bottom
R2  10,26 180 bottom
R3  19,19 0 bottom
R4  15,58 90 bottom
R5  19,22 0 bottom
R6  15,89 0 bottom
R7  15,91 0 bottom
R8  11,55 270 bottom
R9  18,67 90 bottom
R10  18,61 270 bottom
R11  14.5,61 0 bottom
R12  15,67 0 bottom
R13  19,27 0 bottom
R14  34,39 0 bottom
R15  34,20 0 bottom
R16  9,82 0 bottom
R17  9,84 0 bottom
R18  15,82 180 bottom
R19  15,84 180 bottom
R20  40,8 90 bottom
R21  34,8 90 bottom
R22  37,20 0 bottom
R23  34,63 180 bottom
R24  37,63 0 bottom
R25  20,71 270 bottom
R26  20,74 90 bottom
R27  13,55 270 bottom
R28  21,50 0 bottom
R29  24,50 180 bottom
R30  20,61 270 bottom
R31  20,67 90 bottom
TP1  37,38 0 bottom
TP2  18,57 0 bottom
TP3  11,61 0 bottom
TP4  20,69 0 bottom
TP5  22,60 0 bottom
TP8  17,84 0 bottom
TP9  17,82 0 bottom
TR1  Z0107MNSOT-223  [SOT223']  19,13 180 bottom
U1  31,87 0 bottom

### Tracks (layer width: path | path; a pad name or v marks a point on that pad's centre or on a via)
3V3  (via drill 0.35)  (1 unrouted)
  Top 0.61: J5.3 12.38,71.62 20.12,71.62 v21,72.5 21.02,72.52 28.48,72.52 29.81,71.19 J3.1 | v32,57 v29,57
  Bottom 0.254: R14.2 24.85,39 | U1.3 40.83,89.72 41.02,89.92 41.02,90.81 40.84,90.99 U1.2 | R23.1 33.15,58.15 v32,57 | R26.1 20.65,72.5 | R25.1 20.65,72.5 | 20.65,72.5 v21,72.5
  Bottom 0.61: C16.1 R17.2 R16.2 8.15,73.13 9.28,72 J5.3 | R23.1 33,62.85 | 37.98,62.87 R24.1 C15.1 39.15,62.01 37.5,60.36 J2.2 37.5,57.69 36.81,57 v32,57 | v29,57 29.64,57.63 29.64,63.6 28.87,64.36 | C1.1 28.87,63.98 28.87,64.36 | C2.1 28.87,65.98 28.87,64.36
  Bottom 0.914: 37.08,89.59 38.48,90.99 U1.2
  Bottom 1.016: IC1.4 24.85,39 C7.1 C9.1
  Bottom 1.27: IC1.4 32.1,38.85 33.91,40.66 33.91,43.63 29.81,47.73 J3.1 29.81,77.03 37.08,84.31 37.08,89.59
3WAY
  Bottom 1.27: R13.2 16.11,27 11.54,22.43 J13.A2
  Bottom 1.778: J13.A1 1.91,24.45 1.91,36.52 K1.8
  Bottom 2.54: J13.A1 J13.A2
5V  (via drill 0.35)  (1 unrouted)
  Top 0.305: J15.B9 22.46,53.3 24.75,51.01 27.01,51.01 28.19,52.19 28.19,53.58 27.79,53.98 26.59,53.98 26.3,53.7 J15.B4
  Top 0.61: v15,64 15,56.91 12.65,54.56 | v15.5,53.6 15.45,53.55 15.45,51.77
  Top 1.27: J1.1 5.62,62.62 5.62,61.6 12.65,54.56 15.45,51.77 24.97,42.25 PSU1.+V
  Bottom 0.254: R11.2 13.65,61.39 15,62.74 v15,64 15,65.26 14.15,66.11 R12.2 | 15.4,53.6 v15.5,53.6 15.5,52.75 LED1.A 13.05,51.25 K1.2
  Bottom 0.305: 26.3,53.68 26.6,53.98 27.79,53.98
  Bottom 0.406: 26.3,53.68 J15.B4 J15.A9 | 27.79,53.98 28.19,53.58 28.19,50.34 C10.1 | J15.A4 J15.B9
  Bottom 0.508: Q4.S1 v15,64 Q4.S2
  Bottom 0.61: J1.1 8.85,63 C4.1
  Bottom 1.016: IC1.3 27.85,45.7 C8.1 C10.1 | J6.1 C11.1
  Bottom 1.27: IC1.3 27.97,45.15 30.87,42.25 PSU1.+V | J1.1 5.24,63 4.19,64.05 4.19,80 | J8.4 4.19,80 | J6.1 11.07,94 4.19,87.12 4.19,80
AC_N
  Bottom 0.305: R21.1 31.17,3.75 PSU1.AC/N
  Bottom 1.27: PSU1.AC/N 27.25,5 J10.A2
  Bottom 2.54: J10.A1 J10.A2
AC_P
  Top 0.508: 1.91,30.48 4.89,30.48 OK2.4
  Top 0.61: PSU1.AC/L 33,10 J11.A2
  Top 1.27: J11.A1 J11.A2
  Top 1.778: J11.A1 1.91,14.45 1.91,30.48 1.91,43.7 K1.6
  Bottom 0.305: R20.1 40,4.5 PSU1.AC/L
  Bottom 1.27: TR1.2 19,10.1 18.9,10 23.4,10 C5.1 C13.1
  Bottom 2.54: J11.A1 J11.A2 18.9,10 TR1.4
BREW  (via drill 0.35)
  Top 0.254: v17,83 v24,83
  Bottom 0.254: C21.1 R18.2 TP9.1 v17,83 | U1.20 22.85,82.1 23.75,83 v24,83
CC1
  Bottom 0.152: R28.1 21.85,50.2 23.48,51.83 23.48,52.48 22.65,53.31 J15.A5
CC2
  Bottom 0.152: J15.B5 23.88,51.83 23.88,51.24 23.15,50.51 R29.1
GND  (via drill 0.35)  (1 unrouted)
  Top 0.406: J15.B1 27.25,53.17 26.15,52.07 J15.SHLD4
  Top 0.508: OK2.2 16,38 v17,38
  Bottom 0.254: Q12.1 17.59,64.92 16.95,65.56 16.95,68.05 v16,69 | v22,63 20.85,61.85 R30.1 20,62.73 Q12.4
  Bottom 0.406: 27.25,53.19 26.13,52.07 J15.SHLD4 | J15.B1 27.25,53.17 26.15,52.07 J15.SHLD4 | J15.SHLD3 21.87,52.07 20.75,53.19 J15.A1 20.75,54.81 21.87,55.93 J15.SHLD1 21.93,56 v20,56 | J15.B12 20.75,53.17 21.85,52.07 J15.SHLD3 | J15.A12 27.25,54.83 26.15,55.93 | v28,56 26.09,56 | v20,52 21.93,52 J15.SHLD3 | J15.SHLD4 26.15,51.92 C10.2
  Bottom 0.61: v13,96 13.98,96 15.85,94.13 C11.2 16.01,94 17,93.01 v17,92.5
  other vias: 5,60 40,59 17,40 5,59 36,43 36,42 23,48 36,44 6,85 9.5,67 30,45 17,42 12,96 18,52 8,71 19,45 20,44 7,58 37,55 41,55 6,58 23,47 24,47 22,48 16.9,59 20,45 19,46 19,50 18,59 13,62.2 6,86 2.5,68 2.5,70 2.5,69 2.5,78 2,72 6,59 27,62.5 9.5,74 21,44 9,97 2.5,79 2.5,77 2.5,67 2,60 29,37.5 31,37.5 34,37.5 31,40.5 8,65 31,44 30,40.5 29,40.5 36,41 37,40 38,40 39,40 40,40 43,46 43,51 42.5,60.5 38,54 36,54 2,92 2,84 10,95 4,90 2,87 30,81 29,80 28,78 32,83 28,82 27,83 30,84 13,73 18,73 18,74 18,89.5 11,80 29,85 27,87 33,90 40,74 43.5,92 42.5,92.5 41.5,92.5 38,92.5 37,92.5 36,92.5 35,92.5 34,92.5 33.1,87.8 31.9,87.8 33.8,87.2 32.5,87.2 31.3,87.2 33.1,86.6 31.9,86.5 33.8,85.9 32.5,85.9 33.1,85.3 31.9,85.3 31.3,85.9 24,92.5 25,92.5 26,92.5 27,92.5 28,92.5 29,92.5 30,92.5 31,92.5 32,92.5 33,92.5 20,92.5 19,92.5 16,92.5 18,92.5 12,97 11,98 7,98.5 8,98.5 9,98.5 10,98.5 17,87 28,74 32,70 27,68 34,75 35,75 36,75 40,73 40,72 40,71 36,70 23,64 22,64 18,70 41,66 43,68 42,89 43,87 34,72 36,66 32,61 32,59 28,58 42,38 23,58 20,90 12,88 24,76 22,67 21,64
  pour Top: 0,100 10,100 17,93 45,93 45,37 16,37 16,44 0,60
  pour Bottom: 0,100 10,100 17,93 45,93 45,37 16,37 16,44 0,60
I2C1_SCL
  Bottom 0.254: J2.4 35.5,59.37 34.85,60.02 R23.2 34.85,63.38 41.15,69.68 41.15,84.07 40.58,84.64 U1.7
I2C1_SDA
  Bottom 0.254: J2.3 36.5,59.64 36.15,59.99 R24.2 36.15,63.51 41.91,69.27 41.91,84.58 40.58,85.91 U1.6
IO8  (via drill 0.35)
  Top 0.254: v32,73 32,71.25 30.61,69.86 28.41,69.86 J3.2
  Bottom 0.254: U1.10 36.89,80.83 32,75.94 v32,73 | R25.2 20.29,69.86 26.13,69.86 J3.2
IO9
  Bottom 0.254: R26.2 20.9,75.75 U1.15 24.73,73.27 J3.3
IO19  (via drill 0.35)
  Top 0.254: J8.1 9.22,77.22 14.86,77.22 16.63,79 v24,79
  Bottom 0.254: U1.17 22.91,78.29 23.62,79 v24,79
IO20  (via drill 0.35)
  Top 0.254: J8.2 8.1,78.09 14.09,78.09 16,80 v24,80
  Bottom 0.254: U1.18 22.79,79.56 23.23,80 v24,80
IO21  (via drill 0.35)
  Top 0.254: J8.5 9,79 13.49,79 15.49,81 v24,81
  Bottom 0.254: U1.19 23.83,80.83 v24,81
N$2
  Bottom 0.305: B1.- 38.3,19.55 R22.1 37.85,21.8 39.84,23.79 | 39.84,23.79 D5.C | Q1.1 39.84,25.11 39.84,23.79
N$3
  Bottom 0.254: R27.2 13,53.77 14,52.77 LED1.C
N$4
  Bottom 0.508: R2.1 9.15,27.56 OK2.6
N$5
  Bottom 0.254: R16.1 11,82 J7.3 13,82 R18.1
N$6
  Bottom 0.254: R17.1 11,84 J7.2 13,84 R19.1
N$7
  Bottom 0.305: OK1.2 34.18,28.7 37.4,28.7 Q1.3
N$8  (via drill 0.35)
  Top 0.508: v12,27 v12,26 13.52,24.48 15.52,24.48 v21,19 v21,18
  Bottom 0.508: R2.2 v12,26 v12,27 | TR1.3 21.31,17.69 v21,18 v21,19 R3.1
N$11
  Bottom 0.254: R8.1 R27.1 13,56.5 Q2.3
N$13
  Bottom 0.254: K1.3 11,52.8 R8.2 | K1.4 K1.3 | K1.3
N$15
  Bottom 1.27: C13.2 28,21.05 22.05,27 R13.1
N$16
  Bottom 1.27: C5.2 25,18.93 21.93,22 R5.1
N$25
  Bottom 0.254: R6.2 13,89 J6.3
N$36
  Bottom 0.305: B1.~1 38.3,10.45 C12.2 39.42,10 R20.2
N$37
  Bottom 0.305: R21.2 34.58,10 C12.1 35.7,10.45 B1.~2
N$39
  Bottom 0.254: OK2.1 15.98,34.39 15.98,51.66 17,52.67 R1.2
N$43
  Bottom 0.305: C6.2 33.15,22.86 34.29,24 D5.A 35.95,24.9 Q1.2
N$44
  Bottom 0.305: R15.2 31.88,21.27 31.88,23.86 OK1.1
N$45
  Bottom 0.305: B1.+ 34.85,18.9 R15.1 | R15.1 R22.2 | R15.1 C6.1
N$46
  Bottom 0.254: Q12.2 19,65.45 18.3,66.15 R9.1
N$47
  Bottom 0.254: R12.1 16.2,66.65 Q4.G1 16.74,64.95 17.53,64.16 19.33,64.16 19.65,64.48 Q12.3
N$48
  Bottom 0.254: R11.1 16.2,61.85 Q4.G2 18.32,63.05 Q12.6
N$49
  Bottom 0.254: Q12.5 19,62.56 18.29,61.85 R10.1
PRESS
  Bottom 0.254: R6.1 R7.1 U1.27
PUMP  (via drill 0.35)
  Top 0.254: v17,70 17,68.47 19,66.47 v19,57
  Bottom 0.254: R1.1 18.15,57 v19,57 TP2.1 | v17,70 17,74.07 19.95,77.02 U1.16
PUMP_P
  Bottom 0.508: TR1.1 16.69,17.54 R3.2
  Bottom 1.27: TR1.1 15.59,15 J12.A2 15.59,15 16.2,15.61 R5.2
  Bottom 2.54: J12.A1 J12.A2
R1
  Bottom 0.508: Q4.D1 12.05,64.95 J9.2
R2
  Bottom 0.508: Q4.D2 12.05,63.05 J9.3
SSR1  (via drill 0.35)
  Top 0.254: v38,79 38.2,79 38.81,78.39 38.81,74.41 29.39,64.99 25.99,64.99 v20,59
  Bottom 0.254: R10.2 R30.2 | R30.2 21.85,60.15 TP5.1 | v20,59 R30.2 | v38,79 38.26,79.26 39.45,79.26 U1.11
SSR2  (via drill 0.35)
  Top 0.254: v38,78 38,74.39 29.16,65.54 21.46,65.54 v18,69
  Bottom 0.254: v18,69 R9.2 R31.2 TP4.1 | v38,78 39.1,78 39.39,78.29 U1.12 | U1.12
STEAM  (via drill 0.35)
  Top 0.254: v17,85 18,84 v24,84
  Bottom 0.254: C20.1 R19.2 TP8.1 v17,85 | U1.21 22.86,83.37 23.49,84 v24,84
TEMP
  Bottom 0.254: J5.2 18.03,80.03 18.03,86.11 21.65,89.72 U1.26
UART_RX
  Bottom 0.254: J1.2 10.47,69.47 12.38,69.47 14.73,71.83 14.73,74.42 19.56,79.25 19.56,85.09 21.65,87.18 U1.24
UART_TX
  Bottom 0.254: U1.25 21.65,88.45 18.8,85.6 18.8,79.63 13.97,74.8 13.97,72.36 11.97,70.36 9.36,70.36 J1.3
USB_DN  (via drill 0.35)
  Top 0.254: J15.A7 24.45,56.09 38,69.64 v38,71.5
  Bottom 0.254: J15.A7 24.45,54.45 23.55,53.55 J15.B7 | v38,71.5 38,75.76 39.13,76.89 39.62,76.89 U1.13
USB_DP  (via drill 0.35)
  Top 0.254: J15.B6 24.45,53.55 23.56,54.44 J15.A6 23.55,56.36 37,69.81 v37,70.5
  Bottom 0.254: U1.14 38.99,74.99 38.99,71.22 38.27,70.5 v37,70.5
VALVE
  Bottom 0.254: R4.1 14.33,57.15 12.94,58.54 11.88,58.54 11.05,59.37 Q2.1 11.05,60.95 TP3.1 10.49,61.51 10.49,67.66 11.46,68.63 12.82,68.63 15.57,71.38 15.57,73.99 20.32,78.74 20.32,84.58 21.65,85.91 U1.23
ZC
  Bottom 0.254: OK1.4 35.27,38.1 | 35.27,38.1 35.27,38.58 R14.1 35.1,39.25 35.1,43.83 31.24,47.69 31.24,76.53 38.09,83.37 U1.8 | TP1.1 35.37,38 35.27,38.1

### Text on the board
tPlace: 5V / G / P | G / S / B | IO21 / 5V / GND / IO20 / IO19 | G / T / 3V3 | GND / IO9/BOOT / IO8 / 3V3 | G / TX / RX / 5V | G / R1 / R2 | DANGER! HIGH VOLTAGE! | 3 / / P / / L / / N
bPlace: DANGER! HIGH VOLTAGE!
tNames: CleverBoard_V1